# Altium project P1.PrjPcb
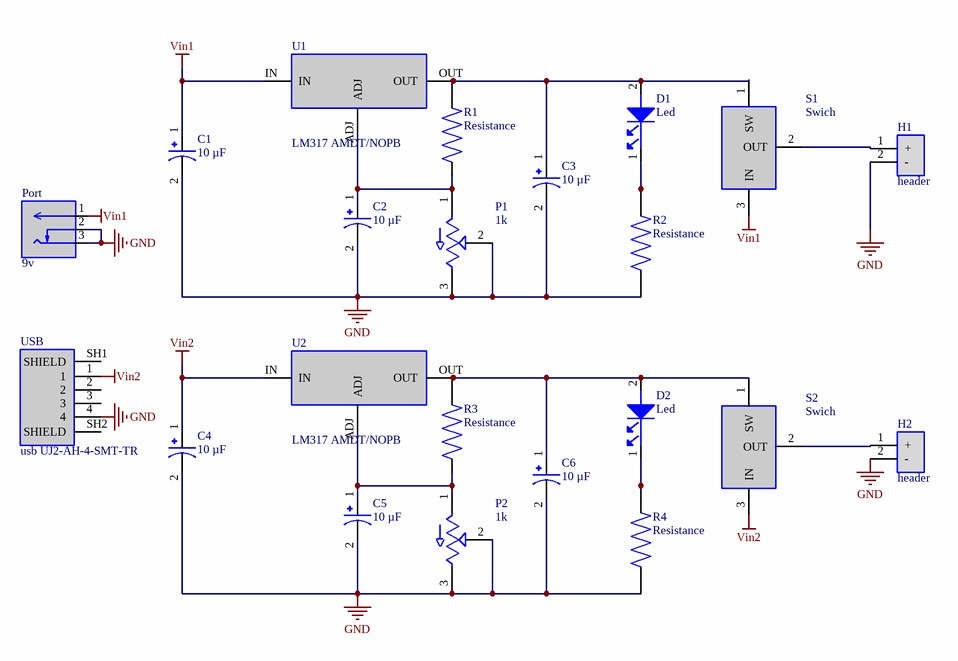
[diagram p0: P1.SchDoc]
1 sheet, 22 parts. Net scope: global (net labels, ports and power ports of the same name join across sheets).
Board file: P1.PcbDoc

## Sheet P1.SchDoc
size A4; SheetNumber: 1; SheetTotal: 1

### Parts
C1  10 µF  [capacitores]
C2  10 µF  [capacitores]
C3  10 µF  [capacitores]
C4  10 µF  [capacitores]
C5  10 µF  [capacitores]
C6  10 µF  [capacitores]
D1  Led  [leds]
D2  Led  [leds]
H1  header  [headers]
H2  header  [headers]
P1  1k  [potenciometro]
P2  1k  [potenciometro]
Port  9v  [puerto 9v]
R1  Resistance  [resistencias]
R2  Resistance  [resistencias]
R3  Resistance  [resistencias]
R4  Resistance  [resistencias]
S1  Swich  [switchs]
S2  Swich  [switchs]
U1  LM317 AMDT/NOPB  [Lm317]
U2  LM317 AMDT/NOPB  [Lm317]
USB  usb UJ2-AH-4-SMT-TR  [usb]

### Nets
GND: C1.2 C2.2 C3.2 C4.2 C5.2 C6.2 H1.2(-) H2.2(-) P1.2(W) P1.3(CW) P2.2(W) P2.3(CW) Port.2(SHUNT) Port.3(TIP) R2.1 R4.1 USB.4
Vin1: C1.1 Port.1(PIN) S1.3(IN) U1.IN
Vin2: C4.1 S2.3(IN) U2.IN USB.1
NetC2_1: C2.1 P1.1(CCW) R1.1 U1.ADJ
NetC3_1: C3.1 D1.2 R1.2 S1.1(SW) U1.OUT
NetC5_1: C5.1 P2.1(CCW) R3.1 U2.ADJ
NetC6_1: C6.1 D2.2 R3.2 S2.1(SW) U2.OUT
NetD1_1: D1.1 R2.2
NetD2_1: D2.1 R4.2
NetH1_1: H1.1(+) S1.2(OUT)
NetH2_1: H2.1(+) S2.2(OUT)

Not connected (* = marked no-connect by the designer): USB 2 3 SH1(SHIELD) SH2(SHIELD)

### Library data of the parts
C1-C6 = capacitores TAJA106K016SNJ: AVX - TAJA106K016SNJ - Condensador de Tantalio SMD, 10 µF, 16 V, 1206 [Métrica 3216], TAJ Series, ± 10%, -55 °C; Manufacturer: Kyocera AVX; Capacitance: 10uF; ESR (Equivalent Series Resistance): 3R; Voltage Rating: 16V; Leakage Current: 1.6uA; Polarity: Polar; Dissipation Factor: 8%; Supplier 1: Digi-Key; Supplier Part Number 1: 478-8875-1-ND; Manufacturer Part Number: TAJA106K016SNJ; RoHS: Yes; Category: Tantalum Capacitors; Stock 1: 7233; Pricing 1: 1=0,32000, 10=0,22600, 50=0,15780, 100=0,13530, 500=0,10148, 1000=0,08569, 2500=0,08118 (USD); Mount: Surface Mount; Case/Package: 1206; Number of Pins: 2; Case Code (Metric): 3216; Case Code (Imperial): 1206; Min Operating Temperature: -55°C; Max Operating Temperature: 125°C; Packaging: Tape and Reel; Tolerance: 10%; Package Quantity: 1; Termination: SMD/SMT; Voltage Rating (DC): 16V; Features: General Purpose; Series: TAJ; Construction: Flat; Length: 3.2mm; Width: 0.063inch; Height: 1.8mm; Height - Seated (Max): 0.071inch; Depth: 1.6mm; Radiation Hardening: No; Lead Free: Lead Free; RoHS Compliant: Yes; ComponentLink1URL: https://datasheet.ciiva.com/12907/taj-27497-12907453.pdf?src-supplier=Mouser; ComponentLink1Description: https://datasheet.ciiva.com/12907/taj-27497-12907453.pdf?src-supplier=Mouser; ComponentLink2URL: https://datasheet.ciiva.com/29500/taj-29500092.pdf?src-supplier=Digi-Key; ComponentLink2Description: https://datasheet.ciiva.com/29500/taj-29500092.pdf?src-supplier=Digi-Key; ComponentLink3URL: https://datasheet.ciiva.com/29500/taj-29500093.pdf?src-supplier=Digi-Key; ComponentLink3Description: https://datasheet.ciiva.com/29500/taj-29500093.pdf?src-supplier=Digi-Key; ComponentLink4URL: https://datasheet.ciiva.com/29500/taj-29500094.pdf?src-supplier=Digi-Key; ComponentLink4Description: https://datasheet.ciiva.com/29500/taj-29500094.pdf?src-supplier=Digi-Key
D1 D2 = 598-8020-107F: DIALIGHT   5988020107F   LED, RED ORANGE, 150MCD, 630NM; Color: Red,Orange; Lens Color: Colorless,Clear; Forward Current: 20mA; Viewing Angle: 140°; Forward Voltage: 2V; Lens Style: Flat,Diffused,Colorless,Rectangular,WATER CLEAR; Dominant Wavelength: 625nm; Number of Elements: 1; Power Dissipation: 55mW; Reverse Voltage: 5V; Lens Transparency: Clear; Lens Size: 0.8mm; Supplier 1: Digi-Key; Supplier Part Number 1: 350-2030-1-ND; Manufacturer: Dialight; Manufacturer Part Number: 598-8020-107F; RoHS: Yes; Category: LEDs; Stock 1: 16102; Pricing 1: 1=0,34000, 10=0,27100, 100=0,12160, 500=0,10982, 1000=0,09021, 2000=0,07844 (USD); Mount: Surface Mount; Case/Package: 0603; Number of Pins: 2; Case Code (Metric): 1608; Case Code (Imperial): 0603; Min Operating Temperature: -30°C; Max Operating Temperature: 100°C; Packaging: Tape and Reel; Package Quantity: 4000; Wavelength: 630nm; Luminous Intensity: 150mcd; Illumination Color: Orange; Test Current: 20mA; Number of LEDs: 1; Series: 598; Length: 1.6mm; Width: 0.8mm; Height: 0.7mm; Depth: 0.8mm; Radiation Hardening: No; REACH SVHC: No SVHC; Lead Free: Lead Free; RoHS Compliant: Yes; ComponentLink1URL: https://datasheet.ciiva.com/2110/598-series-0603-pkg-2110282.pdf?src-supplier=Digi-Key; ComponentLink1Description: https://datasheet.ciiva.com/2110/598-series-0603-pkg-2110282.pdf?src-supplier=Digi-Key; ComponentLink2URL: https://datasheet.ciiva.com/2110/598-series-0603-pkg-2110283.pdf?src-supplier=Digi-Key; ComponentLink2Description: https://datasheet.ciiva.com/2110/598-series-0603-pkg-2110283.pdf?src-supplier=Digi-Key; ComponentLink3URL: https://datasheet.ciiva.com/2110/598-series-0603-pkg-2110284.pdf?src-supplier=Digi-Key; ComponentLink3Description: https://datasheet.ciiva.com/2110/598-series-0603-pkg-2110284.pdf?src-supplier=Digi-Key; ComponentLink4URL: https://datasheet.ciiva.com/15965/mdei5980603-15965337.pdf?src-supplier=Onlinecomponents.com; ComponentLink4Description: https://datasheet.ciiva.com/15965/mdei5980603-15965337.pdf?src-supplier=Onlinecomponents.com; ComponentLink5URL: https://datasheet.ciiva.com/15118/getdatasheetpartid-187920-15118028.pdf?src-supplier=Verical; ComponentLink5Description: https://datasheet.ciiva.com/15118/getdatasheetpartid-187920-15118028.pdf?src-supplier=Verical; ComponentLink6URL: https://datasheet.ciiva.com/30165/mdei5980603-30165653.pdf?src-supplier=Onlinecomponents.com; ComponentLink6Description: https://datasheet.ciiva.com/30165/mdei5980603-30165653.pdf?src-supplier=Onlinecomponents.com; ComponentLink7URL: https://datasheet.ciiva.com/16400/smt-selector-guide-16400462.pdf?src-supplier=Future+Electronics; ComponentLink7Description: https://datasheet.ciiva.com/16400/smt-selector-guide-16400462.pdf?src-supplier=Future+Electronics; ComponentLink8URL: https://datasheet.ciiva.com/7970/25658-7970173.pdf?src-supplier=Element14; ComponentLink8Description: https://datasheet.ciiva.com/7970/25658-7970173.pdf?src-supplier=Element14; ComponentLink9URL: https://datasheet.ciiva.com/14604/70081985-14604983.pdf?src-supplier=Allied+Electronics; ComponentLink9Description: https://datasheet.ciiva.com/14604/70081985-14604983.pdf?src-supplier=Allied+Electronics
H1 H2 = header 5-146268-1: 02 MODII HDR DRST B/A 100 W/HD; Manufacturer: TE Connectivity; Number of Positions: 2; Connector Type: Plug,Header,Pin; Current Rating: 3A; Insulation Resistance: 5GR; Mating Alignment: No (Without); PCB Mount Retention: With; PCB Mounting Orientation: Vertical; Board Standoff: Yes (With); High Speed Serial Data Connector: No; High Temperature Housing: Yes; Pitch: 2.54mm; Contact Post Length: 0.12inch; PCB Thickness: 0.062inch; Approvals: CSA; Supplier 1: Digi-Key; Supplier Part Number 1: A121475-ND; Manufacturer Part Number: 5-146268-1; RoHS: Yes; Category: Headers and Wire Housings; Stock 1: 803; Pricing 1: 1=0,38000, 10=0,32300, 100=0,25090, 500=0,21510, 1000=0,17925, 5000=0,15364, 10000=0,14340 (USD); Mount: Through Hole; Contact Plating: Gold,Tin,Matte; Contact Material: Bronze; Color: Black; Housing Material: Thermoplastic; Housing Color: Black; Contact Shape: Square; Contact Finish - Mating: GOLD; Insulation Material: Polymer; Min Operating Temperature: -65°C; Max Operating Temperature: 105°C; Number of Rows: 2; Termination: Through Hole; Package Quantity: 1040; Packaging: Carton; Number of Contacts: 2; Series: AMPMODU MOD II; Contact Current Rating: 3A; Contact Type: Male Pin; Orientation: Straight; Mating Connector Lock: No (Without); Contact Gender: Male; Strain Relief: No (Without); Fastening Type: Pull; Contact Protection: No (Without); Gasket: No (Without); Keyed: No; Selectively Loaded: No (Without); Stabilizers: No (Without); Length: 2.13mm; Row Spacing: 2.54mm; Depth: 4.88mm; Contact Mating Length: 0.23inch; Radiation Hardening: No; Lead Free: Lead Free; ELV: Compliant; Flammability Rating: UL94 V-0; RoHS Compliant: Yes; ComponentLink1URL: https://datasheet.ciiva.com/16361/5-146268-1-16361629.pdf?src-supplier=Future+Electronics; ComponentLink1Description: https://datasheet.ciiva.com/16361/5-146268-1-16361629.pdf?src-supplier=Future+Electronics; ComponentLink2URL: https://datasheet.ciiva.com/733/eng-cd-146268-h-146268-1-c-dwg-733414.pdf?src-supplier=Digi-Key; ComponentLink2Description: https://datasheet.ciiva.com/733/eng-cd-146268-h-146268-1-c-dwg-733414.pdf?src-supplier=Digi-Key; ComponentLink3URL: https://datasheet.ciiva.com/9467/eng-ds-1307819-ampmodu-0811-9467416.pdf?src-supplier=Avnet; ComponentLink3Description: https://datasheet.ciiva.com/9467/eng-ds-1307819-ampmodu-0811-9467416.pdf?src-supplier=Avnet; ComponentLink4URL: https://datasheet.ciiva.com/30079/eng-ds-1307819-ampmodu-0811-30079548.pdf?src-supplier=Onlinecomponents.com; ComponentLink4Description: https://datasheet.ciiva.com/30079/eng-ds-1307819-ampmodu-0811-30079548.pdf?src-supplier=Onlinecomponents.com
P1 P2 = potenciometros 35WR1KLFTR: BI TECHNOLOGIES / TT ELECTRONICS         35WR1KLFTR            TRIMMER CERMET,  3MM 1K; Manufacturer: TT BI; Resistance: 1kR; Power Rating: 100mW; Tolerance: 25%; Voltage Rating: 50V; Number of Turns: 1; Insulation Resistance: 100MR; Temperature Coefficient: 250ppm/°C; Supplier 1: Digi-Key; Supplier Part Number 1: 987-1812-1-ND; Manufacturer Part Number: 35WR1KLFTR; RoHS: Yes; Category: Variable Resistors and Potentiometers; Stock 1: 4304; Pricing 1: 1=0,46000, 10=0,42200, 25=0,37680, 50=0,36400, 100=0,33800, 250=0,33152, 500=0,30550, 1000=0,26000 (USD); Min Operating Temperature: -40°C; Max Operating Temperature: 125°C; Packaging: Tape and Reel; Package Quantity: 2000; Resistor Type: Cermet; Termination: SMD/SMT; Voltage Rating (DC): 50V; Type: Potentiometer; Technology: CERMET; Resistance Tolerance: 25%; Series: 35; Length: 3mm; Width: 1.55mm; Depth: 3.65mm; REACH SVHC: No SVHC; Military Standard: Not; Lead Free: Lead Free; RoHS Compliant: Yes; ComponentLink1URL: https://datasheet.ciiva.com/12375/35-2231-12375495.pdf?src-supplier=Mouser; ComponentLink1Description: https://datasheet.ciiva.com/12375/35-2231-12375495.pdf?src-supplier=Mouser; ComponentLink2URL: https://datasheet.ciiva.com/22715/4701-22715103.pdf?src-supplier=Element14; ComponentLink2Description: https://datasheet.ciiva.com/22715/4701-22715103.pdf?src-supplier=Element14; ComponentLink3URL: https://datasheet.ciiva.com/7634/4701-7634924.pdf?src-supplier=Element14; ComponentLink3Description: https://datasheet.ciiva.com/7634/4701-7634924.pdf?src-supplier=Element14
Port = 54-00133: Conn DC Power RCP 2 POS Solder RA Thru-Hole 3 Terminal 1 Port; Manufacturer: Tensility; Body Material: Copper Alloy; Connector Type: Jack; Gender: Male; Shielding: Unshielded; Voltage Rating: 48V; Current Rating: 6A; Supplier 1: Digi-Key; Supplier Part Number 1: 839-1516-ND; Manufacturer Part Number: 54-00133; RoHS: No; Category: Connectors; Stock 1: 4639; Pricing 1: 1=1,05000, 10=0,88900, 25=0,85320, 50=0,83480, 100=0,79860, 250=0,72600, 500=0,65340, 1000=0,58080, 2500=0,52635 (USD); Mount: Through Hole; Contact Plating: Silver; Contact Material: Bronze,Brass; Insulation Color: Black; Housing Material: PBT; Min Operating Temperature: -25°C; Max Operating Temperature: 85°C; Packaging: Bulk; Termination: Solder; ComponentLink1URL: http://www.tensility.com/pdffiles/54-00133.pdf?src-supplier=Digi-Key; ComponentLink1Description: http://www.tensility.com/pdffiles/54-00133.pdf?src-supplier=Digi-Key
R1 R3 = CRCW0805121RFKEA: VISHAY         CRCW0805121RFKEA             SMD Chip Resistor, Thick Film, 121 ohm, 150 V, 0805 [2012 Metric], 125 mW,  1%, CRCW Series; Resistance: 121R; Power Rating: 125mW; Voltage Rating: 150V; Temperature Coefficient: 100ppm/°C; Supplier 1: Digi-Key; Supplier Part Number 1: 541-121CCT-ND; Manufacturer: Vishay; Manufacturer Part Number: CRCW0805121RFKEA; RoHS: Yes; Category: Chip SMD Resistors; Stock 1: 8546; Pricing 1: 1=0,10000, 10=0,06700, 100=0,02710, 1000=0,01219, 2500=0,01058 (USD); Case/Package: 0805; Weight: 0.000194oz; Case Code (Imperial): 0805; Case Code (Metric): 2012; Contact Plating: Tin; Size Code: 0805; Min Operating Temperature: -55°C; Max Operating Temperature: 155°C; Tolerance: 1%; Packaging: Tape and Reel; Package Quantity: 10; Resistor Type: Thick Film; Number of Terminations: 2; Max Power Dissipation: 125mW; Voltage Rating (DC): 150V; Features: Automotive AEC-Q200; Series: CRCW; Construction: Rectangular; Termination: SMD/SMT; Resistance Tolerance: 1%; Technology: THICK FILM; Length: 2mm; Width: 1.25mm; Height: 0.45mm; Depth: 1.25mm; Radiation Hardening: No; Military Standard: Not; Lead Free: Lead Free; RoHS Compliant: Yes; REACH SVHC: Unknown; ComponentLink1URL: https://datasheet.ciiva.com/11810/0900766b80d98b26-11810986.pdf?src-supplier=RSComponents; ComponentLink1Description: https://datasheet.ciiva.com/11810/0900766b80d98b26-11810986.pdf?src-supplier=RSComponents; ComponentLink2URL: https://datasheet.ciiva.com/2467/dcrcwe3-2467515.pdf?src-supplier=Digi-Key; ComponentLink2Description: https://datasheet.ciiva.com/2467/dcrcwe3-2467515.pdf?src-supplier=Digi-Key; ComponentLink3URL: https://datasheet.ciiva.com/2467/dcrcwe3-2467516.pdf?src-supplier=Digi-Key; ComponentLink3Description: https://datasheet.ciiva.com/2467/dcrcwe3-2467516.pdf?src-supplier=Digi-Key; ComponentLink4URL: https://datasheet.ciiva.com/2467/dcrcwe3-2467517.pdf?src-supplier=Digi-Key; ComponentLink4Description: https://datasheet.ciiva.com/2467/dcrcwe3-2467517.pdf?src-supplier=Digi-Key; ComponentLink5URL: https://datasheet.ciiva.com/3258/dcrcwe3-3258073.pdf?src-supplier=Avnet; ComponentLink5Description: https://datasheet.ciiva.com/3258/dcrcwe3-3258073.pdf?src-supplier=Avnet; ComponentLink6URL: https://datasheet.ciiva.com/3258/dcrcwe3-3258074.pdf?src-supplier=Avnet; ComponentLink6Description: https://datasheet.ciiva.com/3258/dcrcwe3-3258074.pdf?src-supplier=Avnet; ComponentLink7URL: https://datasheet.ciiva.com/16449/dcrcwe3-16449435.pdf?src-supplier=Future+Electronics; ComponentLink7Description: https://datasheet.ciiva.com/16449/dcrcwe3-16449435.pdf?src-supplier=Future+Electronics; ComponentLink8URL: https://datasheet.ciiva.com/7823/1697337-7823048.pdf?src-supplier=Element14; ComponentLink8Description: https://datasheet.ciiva.com/7823/1697337-7823048.pdf?src-supplier=Element14; ComponentLink9URL: https://datasheet.ciiva.com/22868/70201119-22868607.pdf?src-supplier=Allied+Electronics; ComponentLink9Description: https://datasheet.ciiva.com/22868/70201119-22868607.pdf?src-supplier=Allied+Electronics; ComponentLink10URL: https://datasheet.ciiva.com/16785/70201119-16785064.pdf?src-supplier=Allied+Electronics; ComponentLink10Description: https://datasheet.ciiva.com/16785/70201119-16785064.pdf?src-supplier=Allied+Electronics
R2 R4 = RCS0805470RJNEA: RES SMD 470 OHM 5% 0.4W 0805; Manufacturer: Vishay Dale; Resistance: 470R; Max Power Dissipation: 400mW; Temperature Coefficient: 200ppm/°C; Supplier 1: Digi-Key; Supplier Part Number 1: 541-2863-1-ND; Manufacturer Part Number: RCS0805470RJNEA; RoHS: Yes; Category: Chip SMD Resistors; Stock 1: 4002; Pricing 1: 1=0,20000, 10=0,16600, 100=0,06480, 1000=0,02712, 2500=0,02486 (USD); Case/Package: 0805; Case Code (Metric): 2012; Case Code (Imperial): 0805; Min Operating Temperature: -55°C; Max Operating Temperature: 155°C; Packaging: Tape and Reel; Resistor Type: Thick Film; Number of Terminations: 2; Tolerance: 5%; Features: Automotive AEC-Q200; Length: 0.079inch; Width: 0.049inch; Height: 0.02inch; ComponentLink1URL: http://www.vishay.com/docs/20065/rcse3.pdf?src-supplier=Digi-Key; ComponentLink1Description: http://www.vishay.com/docs/20065/rcse3.pdf?src-supplier=Digi-Key
S1 S2 = switch CJS-1201TB: Switch Slide DIP SPDT 100MA 6V; Manufacturer: Nidec Copal; Body Material: Polyphenylene; Max Voltage Rating (DC): 24V; Number of Positions: 2; Electrical Life: 200Cycles; Actuator Type: Slide (Standard); Washable: Yes; Supplier 1: Digi-Key; Supplier Part Number 1: 563-1024-1-ND; Manufacturer Part Number: CJS-1201TB; RoHS: Yes; Category: Slide Switches; Stock 1: 6035; Pricing 1: 1=1,02000, 10=0,98500, 25=0,92040, 100=0,79920, 250=0,72720, 500=0,67418 (USD); Mount: Surface Mount; Contact Material: Copper Alloy; Contact Plating: Gold; Min Operating Temperature: -40°C; Max Operating Temperature: 85°C; Throw Configuration: SPDT; Packaging: Tape and Reel; Termination: Gull Wing; Voltage Rating (DC): 6V; Current Rating: 100mA; Series: CJS; Orientation: Vertical; Length: 0.236inch; Radiation Hardening: No; RoHS Compliant: Yes; Lead Free: Lead Free; ComponentLink1URL: https://datasheet.ciiva.com/2864/cjs-2864001.pdf?src-supplier=Digi-Key; ComponentLink1Description: https://datasheet.ciiva.com/2864/cjs-2864001.pdf?src-supplier=Digi-Key; ComponentLink2URL: https://datasheet.ciiva.com/2864/cjs-2864002.pdf?src-supplier=Digi-Key; ComponentLink2Description: https://datasheet.ciiva.com/2864/cjs-2864002.pdf?src-supplier=Digi-Key; ComponentLink3URL: https://datasheet.ciiva.com/2864/cjs-2864003.pdf?src-supplier=Digi-Key; ComponentLink3Description: https://datasheet.ciiva.com/2864/cjs-2864003.pdf?src-supplier=Digi-Key
U1 U2 = LM317 AMDT/NOPB: IC REG LIN POS ADJ 1.5A TO252-3; Manufacturer: TI National Semiconductor; Number of Outputs: 1; Min Input Voltage: 4.2V; Output Voltage: 37V; Max Input Voltage: 40V; Max Output Current: 500mA; Polarity: Positive; Reference Voltage: 1.262V; Accuracy: 1%; Output Type: Adjustable; Min Output Voltage: 1.2V; Quiescent Current: 60uA; Dropout Voltage: 170mV; Tolerance: 2%; Power Supply Rejection Ratio (PSRR): 80dB; Supplier 1: Digi-Key; Supplier Part Number 1: LM317AMDT/NOPB-ND; Manufacturer Part Number: LM317AMDT/NOPB; RoHS: Yes; Category: Voltage Regulators - Linear; Stock 1: 194; Pricing 1: 1=2,66000, 10=2,38800, 25=2,25240, 100=1,91910, 250=1,80200, 500=1,57676, 1000=1,48750 (USD); Mount: Surface Mount; Case/Package: TO-252; Number of Pins: 3; Contact Plating: Tin; Weight: 0.063493oz; Min Operating Temperature: -40°C; Max Operating Temperature: 125°C; Packaging: Rail/Tube; Output Current: 500mA; Max Output Voltage: 37V; Output Voltage Accuracy: 1%; Series: LM317-N; Length: 6.58mm; Width: 6.1mm; Height: 2.3mm; Radiation Hardening: No; REACH SVHC: No SVHC; Lead Free: Lead Free; RoHS Compliant: Yes; ComponentLink1URL: https://datasheet.ciiva.com/19477/837871-19477914.pdf?src-supplier=Jameco; ComponentLink1Description: https://datasheet.ciiva.com/19477/837871-19477914.pdf?src-supplier=Jameco; ComponentLink2URL: https://datasheet.ciiva.com/3223/lm317-n-3223656.pdf?src-supplier=Avnet; ComponentLink2Description: https://datasheet.ciiva.com/3223/lm317-n-3223656.pdf?src-supplier=Avnet; ComponentLink3URL: https://datasheet.ciiva.com/6595/lm117-6595310.pdf?src-supplier=Digi-Key; ComponentLink3Description: https://datasheet.ciiva.com/6595/lm117-6595310.pdf?src-supplier=Digi-Key; ComponentLink4URL: https://datasheet.ciiva.com/1512/1882329-1512362.pdf?src-supplier=Element14; ComponentLink4Description: https://datasheet.ciiva.com/1512/1882329-1512362.pdf?src-supplier=Element14
USB = usb UJ2-AH-4-SMT-TR: USB jack 2.0, standard A type, 4 pin, horizontal, 30 µin plating, SMT; Manufacturer: CUI; Supplier 1: Arrow Electronics; Supplier Part Number 1: UJ2-AH-4-SMT-TR; Manufacturer Part Number: UJ2-AH-4-SMT-TR; RoHS: Yes